# Altium schematic sheet Main.SchDoc: Main
size 292 x 203 mm; DrawnBy: DMGB Nawarathna; DocumentNumber: -; Revision: A; SheetNumber: 1; SheetTotal: 4; Project: Product Sorter; DateDrawn: 4/4/2024
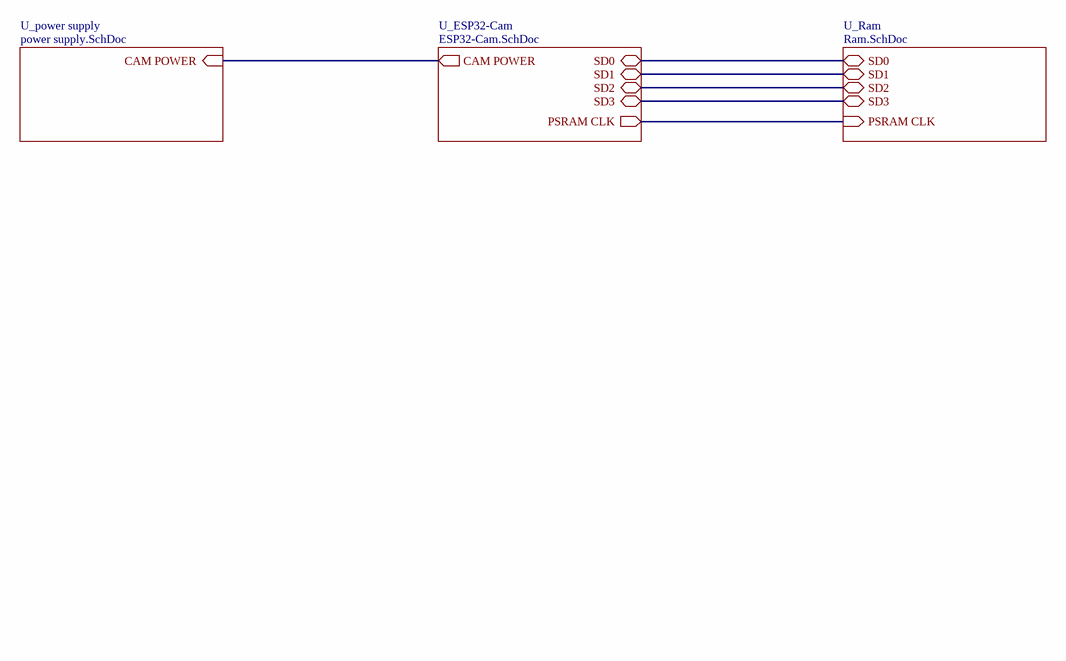
[diagram p0: Main.SchDoc]

## Sub-sheets
U_ESP32-Cam = ESP32-Cam.SchDoc: CAM POWER (out), SD0 (bidir), SD1 (bidir), SD2 (bidir), SD3 (bidir), PSRAM CLK (out)
U_power supply = power supply.SchDoc: CAM POWER (in)
U_Ram = Ram.SchDoc: PSRAM CLK (in), SD1 (bidir), SD0 (bidir), SD3 (bidir), SD2 (bidir)

## Nets
(unnamed): sheet U_ESP32-Cam/CAM POWER, sheet U_power supply/CAM POWER
(unnamed): sheet U_ESP32-Cam/SD0, sheet U_Ram/SD0
(unnamed): sheet U_ESP32-Cam/SD1, sheet U_Ram/SD1
(unnamed): sheet U_ESP32-Cam/SD2, sheet U_Ram/SD2
(unnamed): sheet U_ESP32-Cam/SD3, sheet U_Ram/SD3
(unnamed): sheet U_ESP32-Cam/PSRAM CLK, sheet U_Ram/PSRAM CLK

## Notes on the sheet
- Rev.
- Description
- Revisions
- Date
- Aprvd.
- Title
- SCHEMATIC
- Number
- Drawn
- Chkd.
- Name
- Project
- Sheet      of
- Revision